# EAGLE schematic EEZ DIB module template (isolated) (EAGLE 7.2.0)
Assembly variants: Farnell, TME
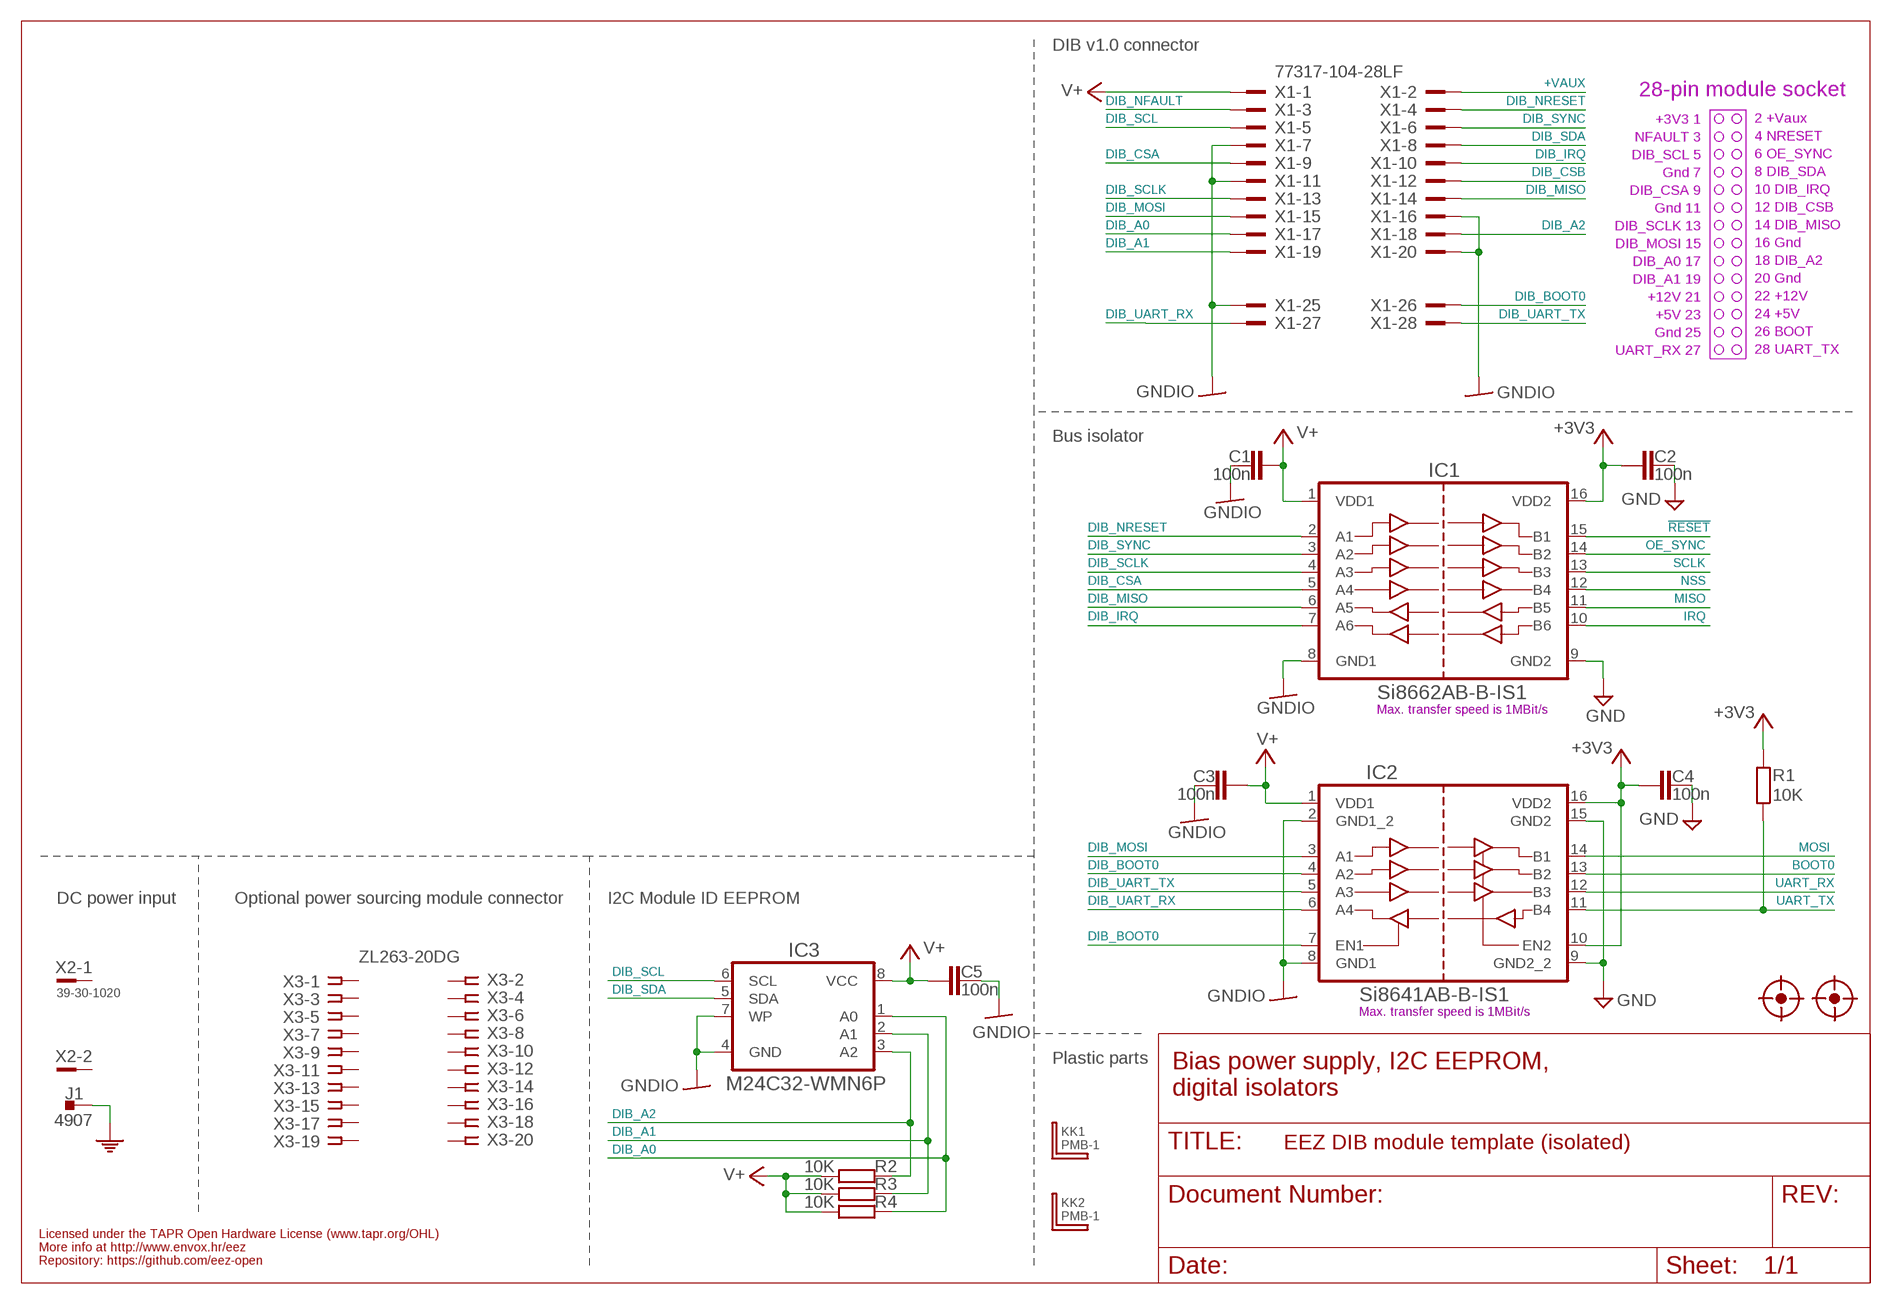
[diagram p0: schematic, sheet 1]

## Parts
C1  100n  C-EUC0603  [C0603]
C2  100n  C-EUC0603  [C0603]
C3  100n  C-EUC0603  [C0603]
C4  100n  C-EUC0603  [C0603]
C5  100n  C-EUC0603  [C0603]
FM1  FIDUCIAL_2  [FIDUCIAL_DUAL]
FM2  FIDUCIAL_2  [FIDUCIAL_DUAL]
IC1  Si8662AB-B-IS1  SI8662NSOIC-16  [SOIC-16]
IC2  Si8641AB-B-IS1  SI8641NSOIC-16  [SOIC-16]
IC3  M24C32-WMN6P  AT24CXXSOIC8  [SOIC127P600X173-8N]
J1  4907  PCB_TAB-4907  [PCB_TAB-4907]
KK1  PMB-1  PCB-MB  [PCB-MB]
KK2  PMB-1  PCB-MB  [PCB-MB]
R1  10K  R-EU_R0805  [R0805]
R2  10K  R-EU_R0805  [R0805]
R3  10K  R-EU_R0805  [R0805]
R4  10K  R-EU_R0805  [R0805]
X1  77317-104-28LF  [77317-104-28LF]
X2  39-30-1020  MINIFIT_39301020  [MINIFIT_39301020]
X3  ZL263-20DG  SSW-110-02-T-D-RA  [SSW-110-02-T-D-RA]

## Nets
!RESET: IC1.15(B1)
+3V3: C2.2 C4.2 IC1.16(VDD2) IC2.10(EN2) IC2.16(VDD2) R1.2
+VAUX: X1.2
BOOT0: IC2.13(B2)
DIB_A0: IC3.1(A0) R4.2 X1.17
DIB_A1: IC3.2(A1) R3.2 X1.19
DIB_A2: IC3.3(A2) R2.2 X1.18
DIB_BOOT0: IC2.4(A2) IC2.7(EN1) X1.26
DIB_CSA: IC1.5(A4) X1.9
DIB_CSB: X1.12
DIB_IRQ: IC1.7(A6) X1.10
DIB_MISO: IC1.6(A5) X1.14
DIB_MOSI: IC2.3(A1) X1.15
DIB_NFAULT: X1.3
DIB_NRESET: IC1.2(A1) X1.4
DIB_SCL: IC3.6(SCL) X1.5
DIB_SCLK: IC1.4(A3) X1.13
DIB_SDA: IC3.5(SDA) X1.8
DIB_SYNC: IC1.3(A2) X1.6
DIB_UART_RX: IC2.6(A4) X1.27
DIB_UART_TX: IC2.5(A3) X1.28
GND: C2.1 C4.1 IC1.9(GND2) IC2.9(GND2_2) IC2.15(GND2)
GNDIO: C1.2 C3.2 C5.1 IC1.8(GND1) IC2.2(GND1_2) IC2.8(GND1) IC3.4(GND) IC3.7(WP) X1.7 X1.11 X1.16 X1.20 X1.25
IRQ: IC1.10(B6)
MISO: IC1.11(B5)
MOSI: IC2.14(B1)
NSS: IC1.12(B4)
OE_SYNC: IC1.14(B2)
PE: J1.1 J1.2
SCLK: IC1.13(B3)
UART_RX: IC2.12(B3)
UART_TX: IC2.11(B4) R1.1
V+: C1.1 C3.1 C5.2 IC1.1(VDD1) IC2.1(VDD1) IC3.8(VCC) R2.1 R3.1 R4.1 X1.1
Unconnected: X1.21 X1.22 X1.23 X1.24 X2.1 X2.2 X3.1 X3.2 X3.3 X3.4 X3.5 X3.6 X3.7 X3.8 X3.9 X3.10 X3.11 X3.12 X3.13 X3.14 X3.15 X3.16 X3.17 X3.18 X3.19 X3.20

## Notes on the sheet
- DIB v1.0 connector
- 28-pin module socket
- +3V3 1
- 2 +Vaux
- NFAULT 3
- 4 NRESET
- DIB_SCL 5
- 6 OE_SYNC
- Gnd 7
- 8 DIB_SDA
- DIB_CSA 9
- 10 DIB_IRQ
- Gnd 11
- 12 DIB_CSB
- DIB_SCLK 13
- 14 DIB_MISO
- DIB_MOSI 15
- 16 Gnd
- DIB_A0 17
- 18 DIB_A2
- DIB_A1 19
- 20 Gnd
- +12V 21
- 22 +12V
- +5V 23
- 24 +5V
- Gnd 25
- 26 BOOT
- UART_RX 27
- 28 UART_TX
- Bus isolator
- Max. transfer speed is 1MBit/s
- DC power input | Optional power sourcing module connector | I2C Module ID EEPROM
- Max. transfer speed is 1MBit/s
- Plastic parts
- Bias power supply, I2C EEPROM,
  digital isolators
- Licensed under the TAPR Open Hardware License (www.tapr.org/OHL)
- More info at http://www.envox.hr/eez
- Repository: https://github.com/eez-open

## Library data of the parts
C1-C5 = rcl:C-EU: CAPACITOR, European symbol
FM1 FM2 = EEZ_Lib1:FIDUCIAL: Fiducial mark for pick and place automation
IC1 = EEZ_Lib1:SI8662: Low power 6-ch digital isolator (4+2) Farnell: 2423351
IC2 = EEZ_Lib1:SI8641: Low power 4-ch digital isolator (3+1) Farnell: 2423288
IC3 = EEZ_Lib1:AT24CXX: I2C-Compatible (2-wire) Serial EEPROM
J1 = EEZ_connectors:PCB_TAB: PCB quick-fit terminal
KK1 KK2 = EEZ_Lib1:PCB-MB: Richo Mounting Block; 16 x 6 mm
R1-R4 = rcl:R-EU_: RESISTOR, European symbol
X1 = EEZ_connectors:77317-104-28LF: Headers & Wire Housings 28P right angle 0.1" pitch
X2 = EEZ_connectors:MINIFIT_39301020: Molex Socket; wire-board; male; Mini-Fit Jr; 4.2mm; PIN:2; THT; PCB snap
X3 = EEZ_connectors:SSW-110-02-T-D-RA: Samtec SSW-113-02-T-D-RA Receptacle, 2.54MM, RA, 20-way

## Net classes
0 default: width 0.203 mm, drill 0.3 mm, clearance 0.203 mm
1 lvds: width 0.152 mm, drill 0.3 mm, clearance 0.152 mm to class 0, clearance 0.152 mm
2 gnd: width 0.254 mm, drill 0.584 mm, clearance 0.254 mm